# Altium schematic sheet [07] - CPU - CSI, FLASH.SchDoc
size A2; DocumentNumber: 7; SheetNumber: 7; SheetTotal: 32
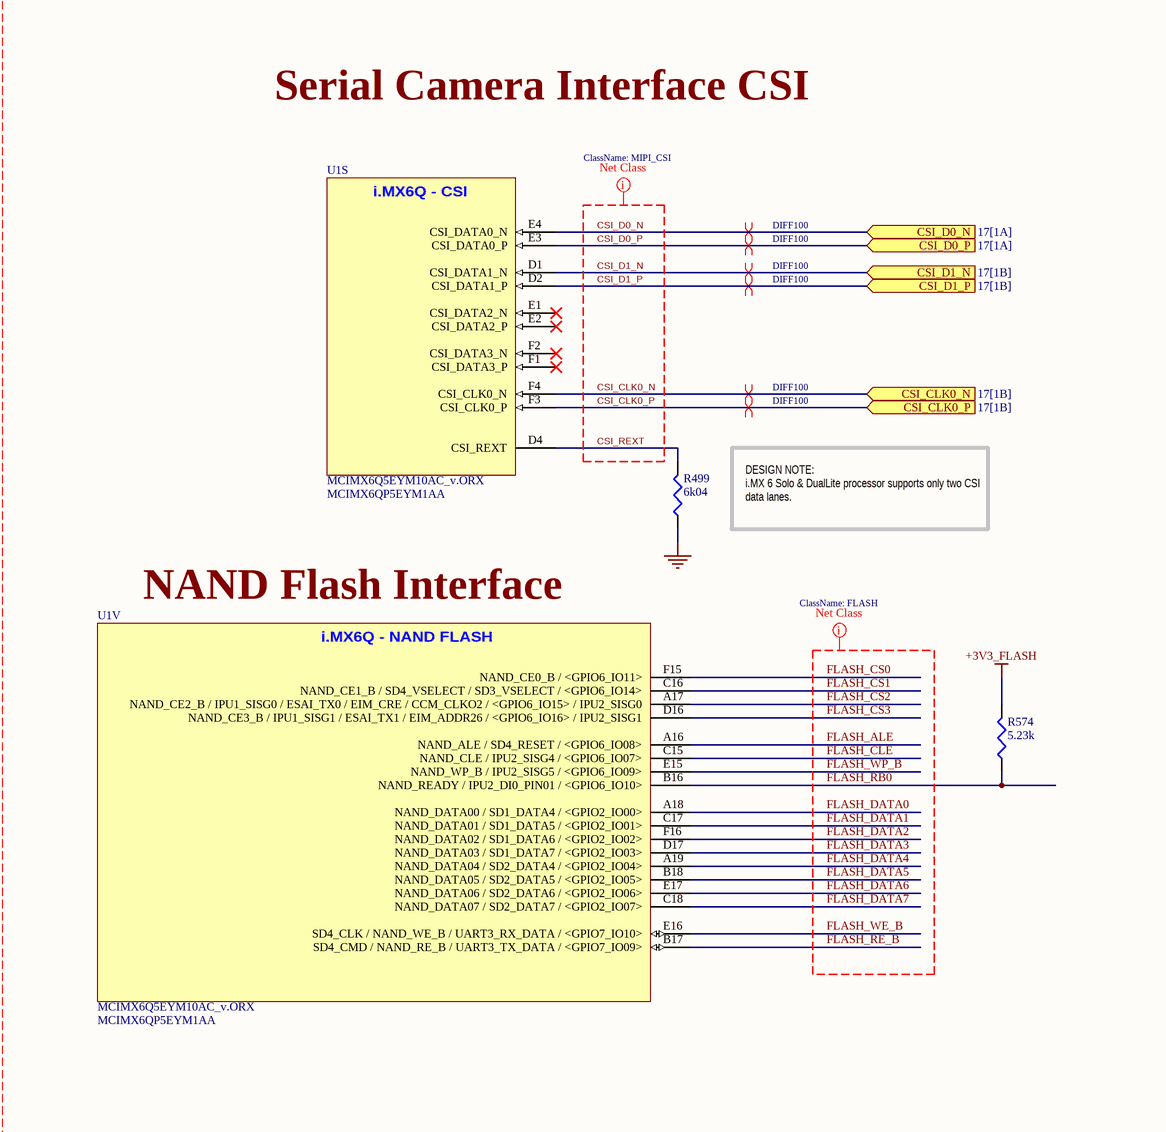
[diagram p0: [07] - CPU - CSI, FLASH.SchDoc, left]
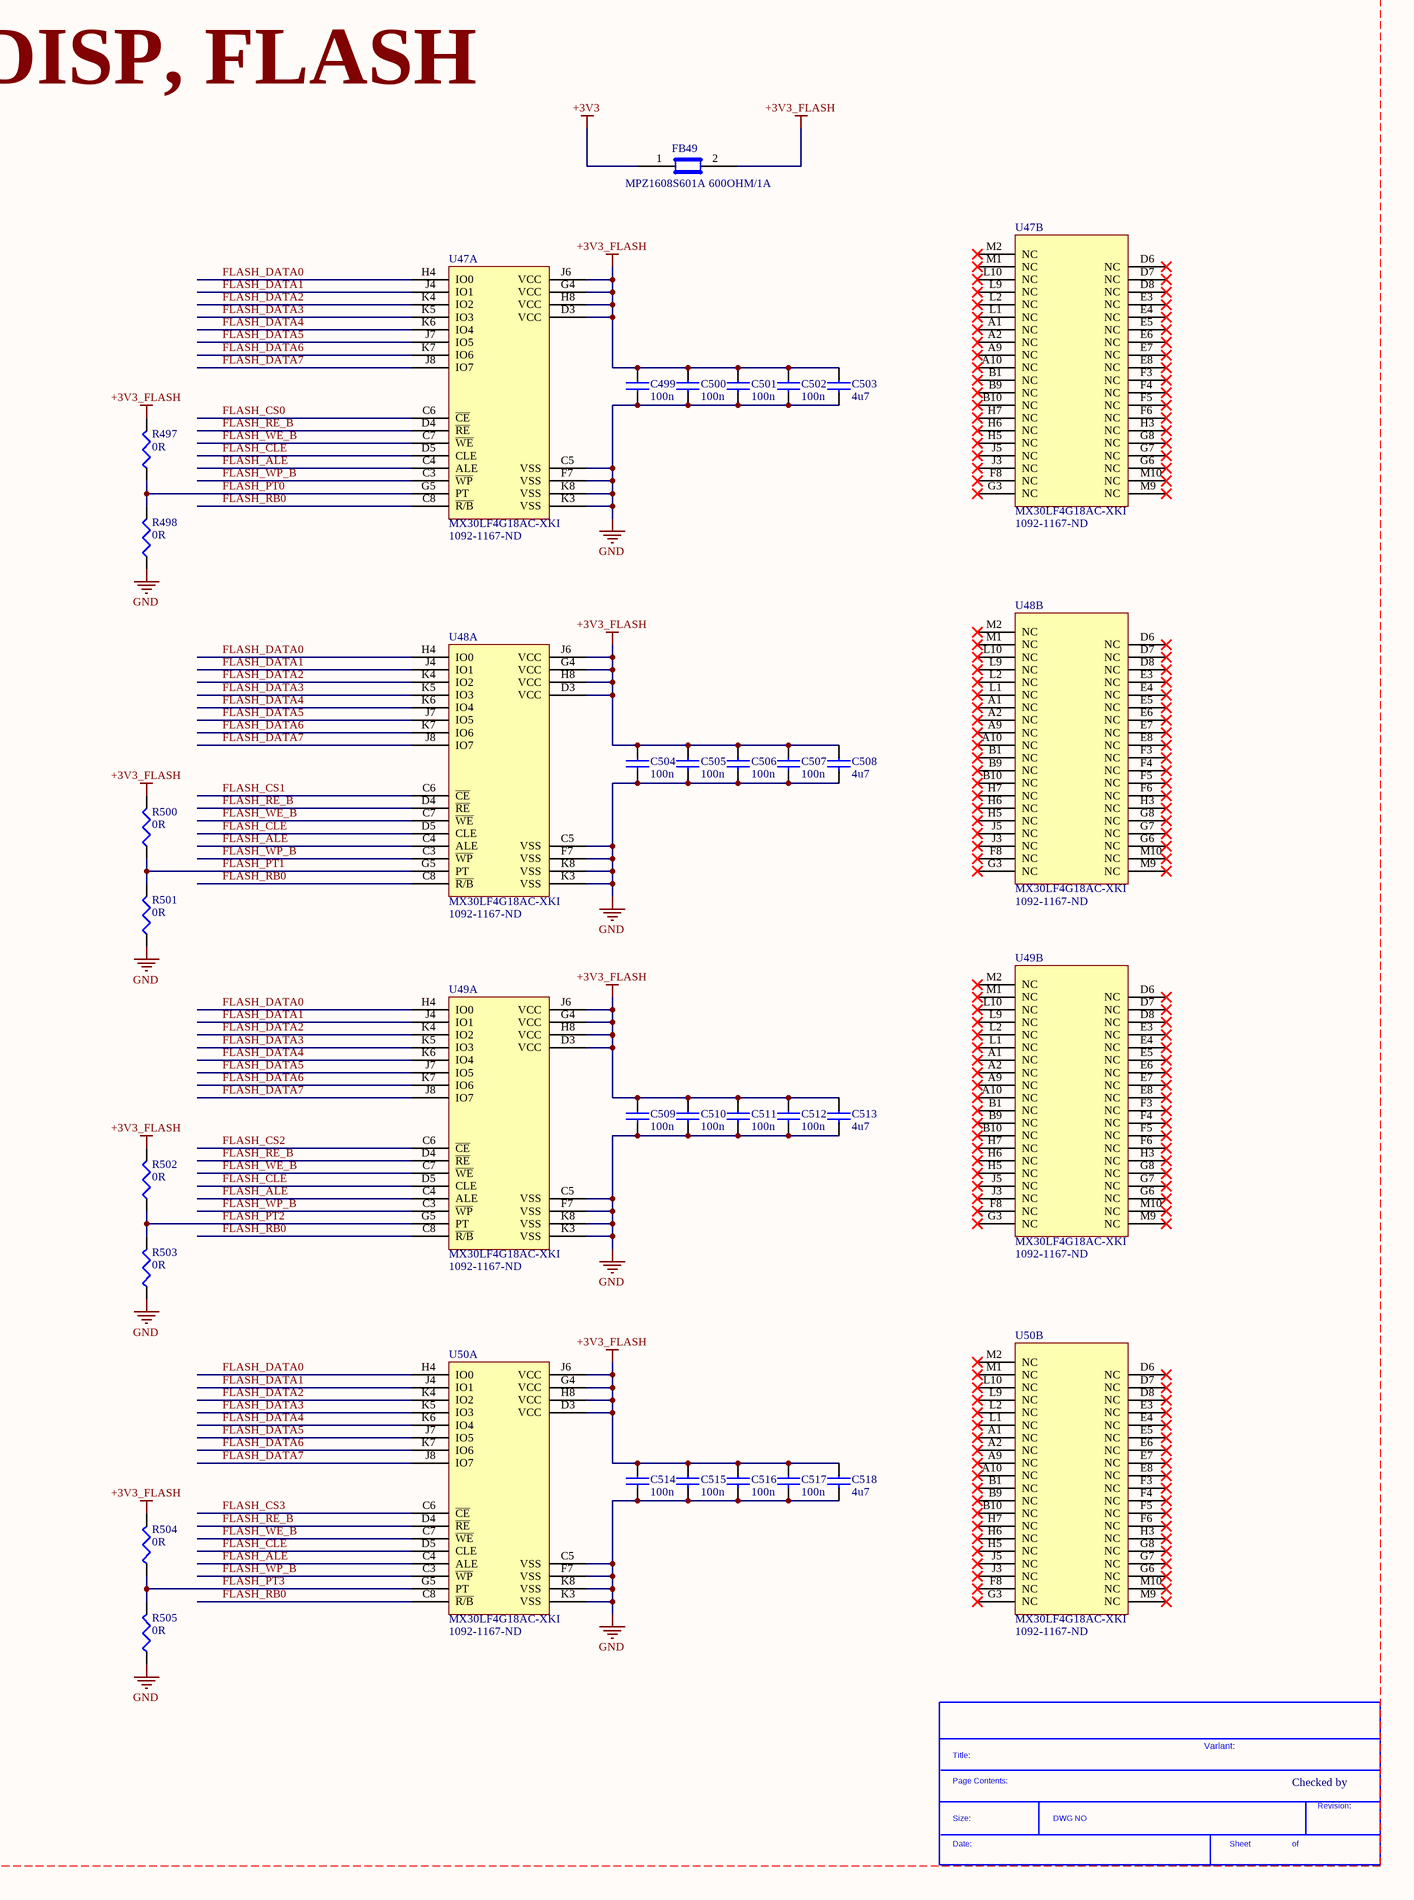
[diagram p1: [07] - CPU - CSI, FLASH.SchDoc, right]

## Parts
*  SDTitleBlock  (value not drawn)  (graphical)
C499  100n  [C0402]
C500  100n  [C0402]
C501  100n  [C0402]
C502  100n  [C0402]
C503  4u7  [C0402]
C504  100n  [C0402]
C505  100n  [C0402]
C506  100n  [C0402]
C507  100n  [C0402]
C508  4u7  [C0402]
C509  100n  [C0402]
C510  100n  [C0402]
C511  100n  [C0402]
C512  100n  [C0402]
C513  4u7  [C0402]
C514  100n  [C0402]
C515  100n  [C0402]
C516  100n  [C0402]
C517  100n  [C0402]
C518  4u7  [C0402]
FB49  MPZ1608S601A 600OHM/1A  [C0603]
R497  0R  [R0402]
R498  0R  [R0402]
R499  6k04  [R0201]
R500  0R  [R0402]
R501  0R  [R0402]
R502  0R  [R0402]
R503  0R  [R0402]
R504  0R  [R0402]
R505  0R  [R0402]
R574  5.23k  [R0402]
U1  MCIMX6Q5EYM10AC_v.ORX  Supplier Part Number 2: MCIMX6QP5EYM1AA  [PBGA624]  (parts S,V of 23)
U47  MX30LF4G18AC-XKI  Supplier Part Number 1: 1092-1167-ND  [BGA63_9X11MM_FLASH]  (parts A,B of 2)
U48  MX30LF4G18AC-XKI  Supplier Part Number 1: 1092-1167-ND  [BGA63_9X11MM_FLASH]  (parts A,B of 2)
U49  MX30LF4G18AC-XKI  Supplier Part Number 1: 1092-1167-ND  [BGA63_9X11MM_FLASH]  (parts A,B of 2)
U50  MX30LF4G18AC-XKI  Supplier Part Number 1: 1092-1167-ND  [BGA63_9X11MM_FLASH]  (parts A,B of 2)

## Ports
CSI_CLK0_N (in, see 17[1B]), CSI_CLK0_P (in, see 17[1B]), CSI_D0_N (in, see 17[1A]), CSI_D0_P (in, see 17[1A]), CSI_D1_N (in, see 17[1B]), CSI_D1_P (in, see 17[1B])

## Nets
+3V3: FB49.1
+3V3_FLASH: C499.1 C500.1 C501.1 C502.1 C503.1 C504.1 C505.1 C506.1 C507.1 C508.1 C509.1 C510.1 C511.1 C512.1 C513.1 C514.1 C515.1 C516.1 C517.1 C518.1 FB49.2 R497.2 R500.2 R502.2 R504.2 R574.2 U47.D3(VCC) U47.G4(VCC) U47.H8(VCC) U47.J6(VCC) U48.D3(VCC) U48.G4(VCC) U48.H8(VCC) U48.J6(VCC) U49.D3(VCC) U49.G4(VCC) U49.H8(VCC) U49.J6(VCC) U50.D3(VCC) U50.G4(VCC) U50.H8(VCC) U50.J6(VCC)
GND: C499.2 C500.2 C501.2 C502.2 C503.2 C504.2 C505.2 C506.2 C507.2 C508.2 C509.2 C510.2 C511.2 C512.2 C513.2 C514.2 C515.2 C516.2 C517.2 C518.2 R498.1 R499.1 R501.1 R503.1 R505.1 U47.C5(VSS) U47.F7(VSS) U47.K3(VSS) U47.K8(VSS) U48.C5(VSS) U48.F7(VSS) U48.K3(VSS) U48.K8(VSS) U49.C5(VSS) U49.F7(VSS) U49.K3(VSS) U49.K8(VSS) U50.C5(VSS) U50.F7(VSS) U50.K3(VSS) U50.K8(VSS)
CSI_CLK0_N: U1.F4(CSI_CLK0_N) ; port CSI_CLK0_N
CSI_CLK0_P: U1.F3(CSI_CLK0_P) ; port CSI_CLK0_P
CSI_D0_N: U1.E4(CSI_DATA0_N) ; port CSI_D0_N
CSI_D0_P: U1.E3(CSI_DATA0_P) ; port CSI_D0_P
CSI_D1_N: U1.D1(CSI_DATA1_N) ; port CSI_D1_N
CSI_D1_P: U1.D2(CSI_DATA1_P) ; port CSI_D1_P
CSI_REXT: R499.2 U1.D4(CSI_REXT)
FLASH_ALE: U1.A16(NAND_ALE_/_SD4_RESET_/_<GPIO6_IO08>) U47.C4(ALE) U48.C4(ALE) U49.C4(ALE) U50.C4(ALE)
FLASH_CLE: U1.C15(NAND_CLE_/_IPU2_SISG4_/_<GPIO6_IO07>) U47.D5(CLE) U48.D5(CLE) U49.D5(CLE) U50.D5(CLE)
FLASH_CS0: U1.F15(NAND_CE0_B_/_<GPIO6_IO11>) U47.C6(~{CE})
FLASH_CS1: U1.C16(NAND_CE1_B_/_SD4_VSELECT_/_SD3_VSELECT_/_<GPIO6_IO14>) U48.C6(~{CE})
FLASH_CS2: U1.A17(NAND_CE2_B_/_IPU1_SISG0_/_ESAI_TX0_/_EIM_CRE_/_CCM_CLKO2_/_<GPIO6_IO15>_/_IPU2_SISG0) U49.C6(~{CE})
FLASH_CS3: U1.D16(NAND_CE3_B_/_IPU1_SISG1_/_ESAI_TX1_/_EIM_ADDR26_/_<GPIO6_IO16>_/_IPU2_SISG1) U50.C6(~{CE})
FLASH_DATA0: U1.A18(NAND_DATA00_/_SD1_DATA4_/_<GPIO2_IO00>) U47.H4(IO0) U48.H4(IO0) U49.H4(IO0) U50.H4(IO0)
FLASH_DATA1: U1.C17(NAND_DATA01_/_SD1_DATA5_/_<GPIO2_IO01>) U47.J4(IO1) U48.J4(IO1) U49.J4(IO1) U50.J4(IO1)
FLASH_DATA2: U1.F16(NAND_DATA02_/_SD1_DATA6_/_<GPIO2_IO02>) U47.K4(IO2) U48.K4(IO2) U49.K4(IO2) U50.K4(IO2)
FLASH_DATA3: U1.D17(NAND_DATA03_/_SD1_DATA7_/_<GPIO2_IO03>) U47.K5(IO3) U48.K5(IO3) U49.K5(IO3) U50.K5(IO3)
FLASH_DATA4: U1.A19(NAND_DATA04_/_SD2_DATA4_/_<GPIO2_IO04>) U47.K6(IO4) U48.K6(IO4) U49.K6(IO4) U50.K6(IO4)
FLASH_DATA5: U1.B18(NAND_DATA05_/_SD2_DATA5_/_<GPIO2_IO05>) U47.J7(IO5) U48.J7(IO5) U49.J7(IO5) U50.J7(IO5)
FLASH_DATA6: U1.E17(NAND_DATA06_/_SD2_DATA6_/_<GPIO2_IO06>) U47.K7(IO6) U48.K7(IO6) U49.K7(IO6) U50.K7(IO6)
FLASH_DATA7: U1.C18(NAND_DATA07_/_SD2_DATA7_/_<GPIO2_IO07>) U47.J8(IO7) U48.J8(IO7) U49.J8(IO7) U50.J8(IO7)
FLASH_PT0: R497.1 R498.2 U47.G5(PT)
FLASH_PT1: R500.1 R501.2 U48.G5(PT)
FLASH_PT2: R502.1 R503.2 U49.G5(PT)
FLASH_PT3: R504.1 R505.2 U50.G5(PT)
FLASH_RB0: R574.1 U1.B16(NAND_READY_/_IPU2_DI0_PIN01_/_<GPIO6_IO10>) U47.C8(~{R/B}) U48.C8(~{R/B}) U49.C8(~{R/B}) U50.C8(~{R/B})
FLASH_RE_B: U1.B17(SD4_CMD_/_NAND_RE_B_/_UART3_TX_DATA_/_<GPIO7_IO09>) U47.D4(~{RE}) U48.D4(~{RE}) U49.D4(~{RE}) U50.D4(~{RE})
FLASH_WE_B: U1.E16(SD4_CLK_/_NAND_WE_B_/_UART3_RX_DATA_/_<GPIO7_IO10>) U47.C7(~{WE}) U48.C7(~{WE}) U49.C7(~{WE}) U50.C7(~{WE})
FLASH_WP_B: U1.E15(NAND_WP_B_/_IPU2_SISG5_/_<GPIO6_IO09>) U47.C3(~{WP}) U48.C3(~{WP}) U49.C3(~{WP}) U50.C3(~{WP})

Not connected (* = marked no-connect by the designer): U1 E1(CSI_DATA2_N)* E2(CSI_DATA2_P)* F1(CSI_DATA3_P)* F2(CSI_DATA3_N)*; U47 A1(NC)* A2(NC)* A9(NC)* A10(NC)* B1(NC)* B9(NC)* B10(NC)* D6(NC)* D7(NC)* D8(NC)* E3(NC)* E4(NC)* E5(NC)* E6(NC)* E7(NC)* E8(NC)* F3(NC)* F4(NC)* F5(NC)* F6(NC)* F8(NC)* G3(NC)* G6(NC)* G7(NC)* G8(NC)* H3(NC)* H5(NC)* H6(NC)* H7(NC)* J3(NC)* J5(NC)* L1(NC)* L2(NC)* L9(NC)* L10(NC)* M1(NC)* M2(NC)* M9(NC)* M10(NC)*; U48 A1(NC)* A2(NC)* A9(NC)* A10(NC)* B1(NC)* B9(NC)* B10(NC)* D6(NC)* D7(NC)* D8(NC)* E3(NC)* E4(NC)* E5(NC)* E6(NC)* E7(NC)* E8(NC)* F3(NC)* F4(NC)* F5(NC)* F6(NC)* F8(NC)* G3(NC)* G6(NC)* G7(NC)* G8(NC)* H3(NC)* H5(NC)* H6(NC)* H7(NC)* J3(NC)* J5(NC)* L1(NC)* L2(NC)* L9(NC)* L10(NC)* M1(NC)* M2(NC)* M9(NC)* M10(NC)*; U49 A1(NC)* A2(NC)* A9(NC)* A10(NC)* B1(NC)* B9(NC)* B10(NC)* D6(NC)* D7(NC)* D8(NC)* E3(NC)* E4(NC)* E5(NC)* E6(NC)* E7(NC)* E8(NC)* F3(NC)* F4(NC)* F5(NC)* F6(NC)* F8(NC)* G3(NC)* G6(NC)* G7(NC)* G8(NC)* H3(NC)* H5(NC)* H6(NC)* H7(NC)* J3(NC)* J5(NC)* L1(NC)* L2(NC)* L9(NC)* L10(NC)* M1(NC)* M2(NC)* M9(NC)* M10(NC)*; U50 A1(NC)* A2(NC)* A9(NC)* A10(NC)* B1(NC)* B9(NC)* B10(NC)* D6(NC)* D7(NC)* D8(NC)* E3(NC)* E4(NC)* E5(NC)* E6(NC)* E7(NC)* E8(NC)* F3(NC)* F4(NC)* F5(NC)* F6(NC)* F8(NC)* G3(NC)* G6(NC)* G7(NC)* G8(NC)* H3(NC)* H5(NC)* H6(NC)* H7(NC)* J3(NC)* J5(NC)* L1(NC)* L2(NC)* L9(NC)* L10(NC)* M1(NC)* M2(NC)* M9(NC)* M10(NC)*

## Layout directives
differential pair; net class DIFF100: CSI_CLK0_N, CSI_CLK0_P, CSI_D0_N, CSI_D0_P, CSI_D1_N, CSI_D1_P
net class MIPI_CSI: CSI_CLK0_N, CSI_CLK0_P, CSI_D0_N, CSI_D0_P, CSI_D1_N, CSI_D1_P, CSI_REXT
net class [07] - CPU - CSI/FLASH: +3V3, +3V3_FLASH, CSI_CLK0_N, CSI_CLK0_P, CSI_D0_N, CSI_D0_P, CSI_D1_N, CSI_D1_P, CSI_REXT, FLASH_ALE, FLASH_CLE, FLASH_CS0, FLASH_CS1, FLASH_CS2, FLASH_CS3, FLASH_DATA0, FLASH_DATA1, FLASH_DATA2, FLASH_DATA3, FLASH_DATA4, FLASH_DATA5, FLASH_DATA6, FLASH_DATA7, FLASH_PT0, FLASH_PT1, FLASH_PT2, FLASH_PT3, FLASH_RB0, FLASH_RE_B, FLASH_WE_B, FLASH_WP_B, GND
net class FLASH: FLASH_ALE, FLASH_CLE, FLASH_CS0, FLASH_CS1, FLASH_CS2, FLASH_CS3, FLASH_DATA0, FLASH_DATA1, FLASH_DATA2, FLASH_DATA3, FLASH_DATA4, FLASH_DATA5, FLASH_DATA6, FLASH_DATA7, FLASH_RB0, FLASH_RE_B, FLASH_WE_B, FLASH_WP_B

## Notes on the sheet
- CPU - CSI, DISP, FLASH
- Serial Camera Interface CSI
- DESIGN NOTE:
  i.MX 6 Solo & DualLite processor supports only two CSI data lanes.
- NAND Flash Interface
- Variant:
- Checked by
- (in symbol MCIMX6Q5EYM10AC_v.ORX, part S) i.MX6Q - CSI
- (in symbol MCIMX6Q5EYM10AC_v.ORX, part V) i.MX6Q - NAND FLASH
- (in symbol SDTitleBlock) Title:; Page Contents:; Revision:; Size:; DWG NO; Date:; Sheet; of

## Library data of the parts
C499-C502 C504-C507 C509-C512 C514-C517 = C1005X5R1H104K: CAP CER .10UF 50V X5R 10% 0402; Manufacturer: TDK Corporation; Capacitance: 0.1µF; Value: 100nF; .Checked PCB: used; Category: Capacitors; Supplier Part Number: 445-5942-1-ND; Manufacturer Part Number: C1005X5R1H104K; Operating Temperature: -55°C ~ 85°C; Package / Case: 0402 (1005 Metric); Price 1k [$]: 0.02340; .Checked SCH: used; Voltage - Rated: 50V; Supplier: Digikey; Supplier 1: Digi-Key; Supplier Part Number 1: 445-5942-1-ND; RoHS: RoHS Compliant; Stock 1: 106926; Pricing 1: 1=0.27, 10=0.18, 100=0.072, 250=0.05176, 500=0.0369, 1000=0.027 (USD); Tolerance: ±10%; Temperature Coefficient: X5R; Mounting Type: Surface Mount, MLCC; Applications: General Purpose; Ratings: -; Size / Dimension: 0.039" L x 0.020" W (1.00mm x 0.50mm); Height - Seated (Max): -; Thickness (Max): 0.022" (0.55mm); Lead Spacing: -; Features: -; Packaging: Cut Tape (CT); Lead Style: -; ComponentLink1URL: http://www.tdk.co.jp/tefe02/e412_c.pdf; ComponentLink1Description: http://www.tdk.co.jp/tefe02/e412_c.pdf; Supplier 2: Digi-Key; Supplier Part Number 2: 311-1697-6-ND
C503 C508 C513 C518 = C1005X5R1A475M: CAP CER 4.7UF 10V 20% X5R 0402; Manufacturer: TDK Corporation; Capacitance: 4.7µF; .Checked PCB: used; Supplier 1: Digi-Key; Supplier Part Number 1: 445-8023-1-ND; Manufacturer Part Number: C1005X5R1A475M; RoHS: RoHS Compliant; Category: Capacitors; Stock 1: 10140; Pricing 1: 1=0.53, 10=0.415, 100=0.25, 250=0.18752, 500=0.16, 1000=0.125, 5000=0.095 (USD); Voltage - Rated: 10V; Tolerance: ±20%; Temperature Coefficient: X5R; Mounting Type: Surface Mount, MLCC; Operating Temperature: -55°C ~ 85°C; Applications: General Purpose; Ratings: -; Package / Case: 0402 (1005 Metric); Size / Dimension: 0.039" L x 0.020" W (1.00mm x 0.50mm); Height - Seated (Max): -; Thickness (Max): -; Lead Spacing: -; Features: -; Packaging: Cut Tape (CT); Lead Style: -; ComponentLink1URL: http://www.tdk.com/pdf/general_B11.pdf; ComponentLink1Description: http://www.tdk.com/pdf/general_B11.pdf; .Checked SCH: used
FB49 = MPZ1608S601A: FERRITE CHIP BEAD 600 OHM SMD 1A; Manufacturer: TDK Corporation; Impedance @ Frequency: 600 Ohm @ 100MHz; DC Resistance (DCR): 150 mOhm Max; Filter Type: Differential Mode - Single; Number of Lines: 1; .Checked PCB: used; Supplier 1: Digi-Key; Supplier Part Number 1: 445-2205-1-ND; Manufacturer Part Number: MPZ1608S601A; RoHS: RoHS Compliant; Category: Filters; Stock 1: 328345; Pricing 1: 1=0.36, 10=0.24, 100=0.096, 250=0.069, 500=0.0492, 1000=0.036 (USD); Current Rating: 1A; Package / Case: 0603 (1608 Metric); Mounting Type: Surface Mount; Packaging: Cut Tape (CT); Height (Max): 0.037" (0.95mm); Size / Dimension: 0.063" L x 0.031" W (1.60mm x 0.80mm); ComponentLink1URL: http://www.tdk.co.jp/tefe02/e9413_mpz.pdf; ComponentLink1Description: http://www.tdk.co.jp/tefe02/e9413_mpz.pdf; .Checked SCH: used
R497 R498 R500-R505 = RC0402JR-070RL: RES 0.0 OHM 1/16W 0402 SMD; Manufacturer: Yageo; Resistance (Ohms): 0.0; Power (Watts): 0.063W, 1/16W; Tolerance: Jumper; .Checked PCB: used; Category: Resistors; Supplier Part Number: 311-0.0JRCT-ND; Manufacturer Part Number: RC0402JR-070RL; Package / Case: 0402 (1005 Metric); Price 1k [$]: 0.01389; Value: 0R; .Checked SCH: used; Supplier: Digikey; Supplier 1: Digi-Key; Supplier Part Number 1: 311-0.0JRCT-ND; RoHS: RoHS Compliant; Stock 1: 1106330; Pricing 1: 10=0.012, 50=0.009, 100=0.0069, 250=0.00512, 500=0.0038, 1000=0.00253 (USD); Composition: Thick Film; Features: -; Temperature Coefficient: -; Size / Dimension: 0.039" L x 0.020" W (1.00mm x 0.50mm); Height: 0.016" (0.40mm); Number of Terminations: 2; Packaging: Cut Tape (CT); ComponentLink1URL: http://www.yageo.com/documents/recent/PYu-RC0402_51_RoHS_L_6.pdf; ComponentLink1Description: http://www.yageo.com/documents/recent/PYu-RC0402_51_RoHS_L_6.pdf
R499 = ERJ-1GEF6041C: RES 6.04K OHM 1/20W 1% 0201 SMD; Manufacturer: Panasonic Electronic Components; Power (Watts): 0.05W, 1/20W; Temperature Coefficient: ±200ppm/°C; .Creator: MM; .Checked PCB: used; Supplier 1: Digi-Key; Manufacturer Part Number: ERJ-1GEF6041C; RoHS: RoHS Compliant; Category: Resistors; Stock 1: 78155; Pricing 1: 1=0.11, 50=0.0414, 100=0.0315, 250=0.0234, 500=0.01728, 1000=0.01152, 5000=0.0081 (USD); Packaging: Cut Tape (CT); Resistance (Ohms): 6.04k; Tolerance: ±1%; Composition: Thick Film; Features: -; Package / Case: 0201 (0603 Metric); Supplier Device Package: 0201; Size / Dimension: 0.024" L x 0.012" W (0.60mm x 0.30mm); Height: 0.010" (0.26mm); Number of Terminations: 2; ComponentLink1URL: http://media.digikey.com/pdf/Data%20Sheets/Panasonic%20Resistors%20Thermistors%20PDFs/ERJ_G,R,E_Rev08.pdf; ComponentLink1Description: http://media.digikey.com/pdf/Data%20Sheets/Panasonic%20Resistors%20Thermistors%20PDFs/ERJ_G,R,E_Rev08.pdf; Supplier Part Number 1: P6.04KABCT-ND; .Checked SCH: used
R574 = CRCW04025K23FKED: RES SMD 5.23K OHM 1% 1/16W 0402; Manufacturer: Vishay Dale; Power (Watts): 0.063W, 1/16W; Temperature Coefficient: ±100ppm/°C; .Creator: MB; Supplier 1: Digi-Key; Manufacturer Part Number: CRCW04025K23FKED; RoHS: RoHS Compliant; Category: Resistors; Stock 1: 224047; Pricing 1: 1=0.1, 10=0.044, 100=0.0178, 1000=0.00802, 2500=0.00696, 5000=0.00575 (USD); Packaging: Cut Tape (CT); Part Status: Active; Tolerance: ±1%; Composition: Thick Film; Features: Automotive AEC-Q200; Operating Temperature: -55°C ~ 155°C; Package / Case: 0402 (1005 Metric); Supplier Device Package: 0402; Size / Dimension: 0.039" L x 0.020" W (1.00mm x 0.50mm); Height - Seated (Max): 0.016" (0.40mm); Failure Rate: -; ComponentLink1URL: http://www.vishay.com/docs/20035/dcrcwe3.pdf; ComponentLink1Description: http://www.vishay.com/docs/20035/dcrcwe3.pdf; Supplier Part Number 1: 541-5.23KLCT-ND; .Checked PCB: *; .Checked SCH: *; Supplier 2: Digi-Key; Stock 2: 246159; Pricing 2: 1=0.1, 10=0.044, 100=0.0178, 1000=0.00802, 2500=0.00696, 5000=0.00575 (USD); Supplier Part Number 2: 541-30.1KLCT-ND
U1 = MCIMX6Q5EYM10AC_v.ORX: IC MCU 32BIT ARM QUAD 624FCBGA; Manufacturer: Freescale Semiconductor; Core Processor: ARM® Cortex™-A9; Core Size: 32-Bit Quad-Core; Speed: 1.0GHz; Connectivity: CAN, EBI/EMI, ESAI, Ethernet, GPMI, I2C, MMC/SD, PCI, SATA, SPI, UART, USB, USB OTG; Peripherals: DMA, HDMI, I2S/SSI/AC97, MIPI CSI, MIMI DSI, MIPI HIS, PWM, WDT; Number of I /O: 224; Program Memory Type: External Program Memory; RAM Size: 256K x 8; Voltage - Supply (Vcc/Vdd): 0.925 V ~ 1.5 V; Oscillator Type: Internal; .Creator: MM; .Checked PCB: used; Supplier 1: Digi-Key; Manufacturer Part Number: MCIMX6Q5EYM10AC; RoHS: RoHS Compliant; Category: Integrated Circuits (ICs); Stock 1: 0; Pricing 1: 1=54.98, 10=51.922, 25=48.868, 100=30.5424 (USD); Program Memory Size: -; EEPROM Size: -; Data Converters: -; Operating Temperature: -20°C ~ 105°C; Package / Case: 624-FBGA, FCBGA; Packaging: Tray; ComponentLink1URL: http://cache.freescale.com/files/32bit/doc/data_sheet/IMX6DQCEC.pdf; ComponentLink1Description: Data Sheet; Supplier Part Number 1: MCIMX6Q5EYM10AC-ND; .Checked SCH: used; ComponentLink2Description: User Guide; ComponentLink2URL: file:///C:/Users/mbeach/Downloads/i.MX_Linux_User's_Guide.pdf; Supplier 2: Arrow
U47-U50 = MX30LF4G18AC-XKI: IC FLASH MEM 4GBIT NAND 63VFBGA; Manufacturer: Macronix; Memory Type: NAND,FLASH; Interface: Parallel; Supplier 1: Digi-Key; Manufacturer Part Number: MX30LF4G18AC-XKI; Number of Pins: 63; Min Operating Temperature: -40°C; Max Operating Temperature: 85°C; Packaging: Tray; ComponentLink1URL: http://www.macronix.com/Lists/Datasheet/Attachments/6517/MX30LF2G18AC,%203V,%202Gb,%20v1.4.pdf; ComponentLink1Description: Data Sheet